# EAGLE schematic generic-clock-controller-r1 (EAGLE 5.12)
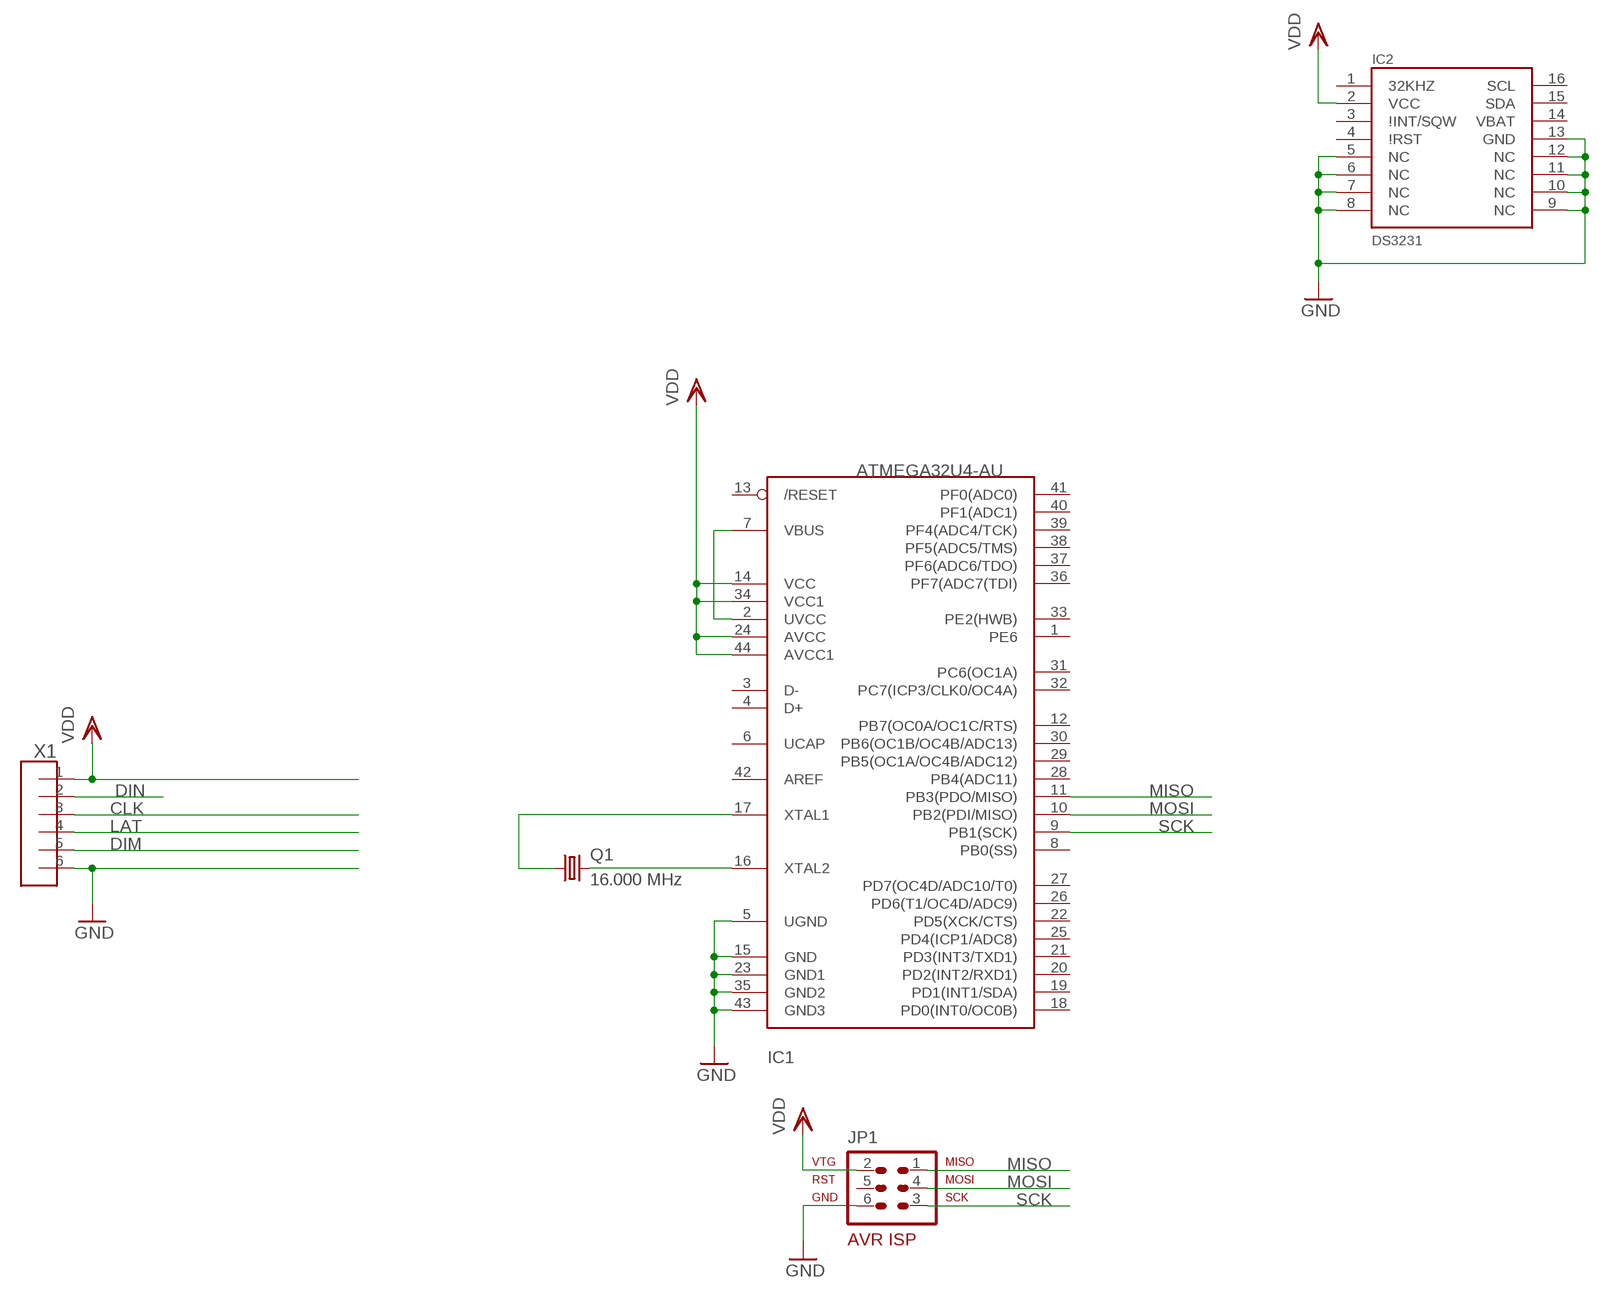
[diagram p0: schematic, sheet 1]

## Parts
IC1  ATMEGA32U4-AU  [TQFP44]
IC2  DS3231  [SO16W]
JP1  AVR-ISP-6  [AVR-ISP-6]
Q1  16.000 MHz  CRYSTALHC49UP  [HC49UP]
X1  M06-100MIL  [100MIL-6]

## Nets
CLK: X1.3
DIM: X1.5
DIN: X1.2
GND: IC1.5(UGND) IC1.15(GND) IC1.23(GND1) IC1.35(GND2) IC1.43(GND3) IC2.5(NC) IC2.6(NC) IC2.7(NC) IC2.8(NC) IC2.9(NC) IC2.10(NC) IC2.11(NC) IC2.12(NC) IC2.13(GND) JP1.6 X1.6
LAT: X1.4
MISO: IC1.11(PB3(PDO/MISO)) JP1.1
MOSI: IC1.10(PB2(PDI/MISO)) JP1.4
N$2: IC1.2(UVCC) IC1.7(VBUS)
N$6: IC1.16(XTAL2) Q1.2
N$7: IC1.17(XTAL1) Q1.1
SCK: IC1.9(PB1(SCK)) JP1.3
VDD: IC1.14(VCC) IC1.24(AVCC) IC1.34(VCC1) IC1.44(AVCC1) IC2.2(VCC) JP1.2 X1.1
Unconnected: IC1.1(PE6) IC1.3(D-) IC1.4(D+) IC1.6(UCAP) IC1.8(PB0(SS)) IC1.12(PB7(OC0A/OC1C/RTS)) IC1.13(/RESET) IC1.18(PD0(INT0/OC0B)) IC1.19(PD1(INT1/SDA)) IC1.20(PD2(INT2/RXD1)) IC1.21(PD3(INT3/TXD1)) IC1.22(PD5(XCK/CTS)) IC1.25(PD4(ICP1/ADC8)) IC1.26(PD6(T1/OC4D/ADC9)) IC1.27(PD7(OC4D/ADC10/T0)) IC1.28(PB4(ADC11)) IC1.29(PB5(OC1A/OC4B/ADC12)) IC1.30(PB6(OC1B/OC4B/ADC13)) IC1.31(PC6(OC1A)) IC1.32(PC7(ICP3/CLK0/OC4A)) IC1.33(PE2(HWB)) IC1.36(PF7(ADC7(TDI)) IC1.37(PF6(ADC6/TDO)) IC1.38(PF5(ADC5/TMS)) IC1.39(PF4(ADC4/TCK)) IC1.40(PF1(ADC1)) IC1.41(PF0(ADC0)) IC1.42(AREF) IC2.1(32KHZ) IC2.3(\!INT/SQW) IC2.4(\!RST) IC2.14(VBAT) IC2.15(SDA) IC2.16(SCL) JP1.5

## Library data of the parts
IC1 = adafruit:ATMEGA32U4: http://www.ladyada.net/library/eagle
IC2 = DS3231:DS3231
JP1 = avr-5:AVR-ISP-6: AVR ISP-6 Serial Programming Header
Q1 = crystal:CRYSTAL: CRYSTAL; OC_FARNELL: unknown; OC_NEWARK: unknown
X1 = rbg-generic-headers:M06-100MIL